# Altium schematic sheet PWR.SchDoc
size A4; SheetNumber: 8; SheetTotal: 8
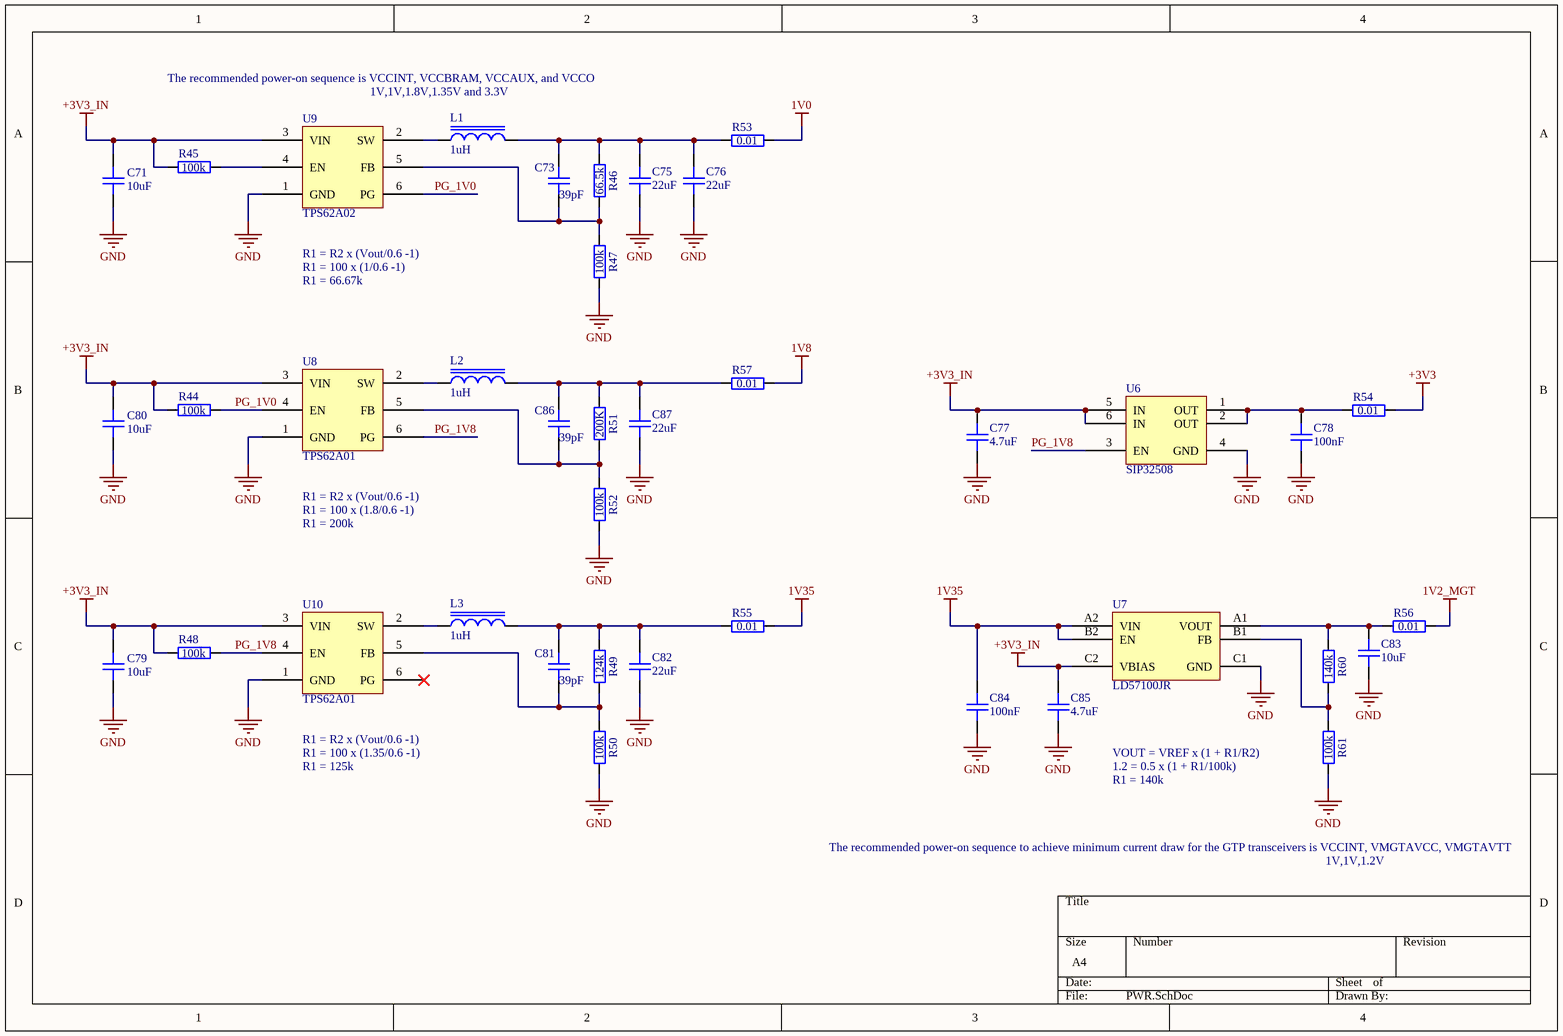
[diagram p0: PWR.SchDoc]

## Parts
C71  10uF  [GEN_C_0603]
C73  39pF  [GEN_C_0402]
C75  22uF  [GEN_C_0805]
C76  22uF  [GEN_C_0805]
C77  4.7uF  [GEN_C_0402]
C78  100nF  [GEN_C_0402]
C79  10uF  [GEN_C_0603]
C80  10uF  [GEN_C_0603]
C81  39pF  [GEN_C_0402]
C82  22uF  [GEN_C_0805]
C83  10uF  [GEN_C_0603]
C84  100nF  [GEN_C_0402]
C85  4.7uF  [GEN_C_0402]
C86  39pF  [GEN_C_0402]
C87  22uF  [GEN_C_0805]
L1  1uH  [GEN_L_1210]
L2  1uH  [GEN_L_1210]
L3  1uH  [GEN_L_1210]
R44  100k  [GEN_R_0402]
R45  100k  [GEN_R_0402]
R46  66.5k  [GEN_R_0402]
R47  100k  [GEN_R_0402]
R48  100k  [GEN_R_0402]
R49  124k  [GEN_R_0402]
R50  100k  [GEN_R_0402]
R51  200K  [GEN_R_0402]
R52  100k  [GEN_R_0402]
R53  0.01  [GEN_R_0603]
R54  0.01  [GEN_R_0603]
R55  0.01  [GEN_R_0603]
R56  0.01  [GEN_R_0603]
R57  0.01  [GEN_R_0603]
R60  140k  [GEN_R_0402]
R61  100k  [GEN_R_0402]
U6  SIP32508  [VISH_TSOT6]
U7  LD57100JR  [ST_FlipChip6]
U8  TPS62A01  [TI_SOT563_DRL0006A]
U9  TPS62A02  [TI_SOT563_DRL0006A]
U10  TPS62A01  [TI_SOT563_DRL0006A]

## Nets
1V0: R53.2
1V2_MGT: R56.2
1V8: R57.2
1V35: C84.2 R55.2 U7.A2(VIN) U7.B2(EN)
+3V3: R54.2
+3V3_IN: C71.2 C77.2 C79.2 C80.2 C85.2 R44.2 R45.2 R48.2 U6.5(IN) U6.6(IN) U7.C2(VBIAS) U8.3(VIN) U9.3(VIN) U10.3(VIN)
GND: C71.1 C75.1 C76.1 C77.1 C78.1 C79.1 C80.1 C82.1 C83.1 C84.1 C85.1 C87.1 R47.1 R50.1 R52.1 R61.1 U6.4(GND) U7.C1(GND) U8.1(GND) U9.1(GND) U10.1(GND)
PG_1V0: R44.1 U8.4(EN) U9.6(PG)
PG_1V8: R48.1 U6.3(EN) U8.6(PG) U10.4(EN)
NetC73_1: C73.1 R46.1 R47.2 U9.5(FB)
NetC73_2: C73.2 C75.2 C76.2 L1.2 R46.2 R53.1
NetC78_2: C78.2 R54.1 U6.1(OUT) U6.2(OUT)
NetC81_1: C81.1 R49.1 R50.2 U10.5(FB)
NetC81_2: C81.2 C82.2 L3.2 R49.2 R55.1
NetC83_2: C83.2 R56.1 R60.2 U7.A1(VOUT)
NetC86_1: C86.1 R51.1 R52.2 U8.5(FB)
NetC86_2: C86.2 C87.2 L2.2 R51.2 R57.1
NetL1_1: L1.1 U9.2(SW)
NetL2_1: L2.1 U8.2(SW)
NetL3_1: L3.1 U10.2(SW)
NetR45_1: R45.1 U9.4(EN)
NetR60_1: R60.1 R61.2 U7.B1(FB)

Not connected (* = marked no-connect by the designer): U10 6(PG)*

## Notes on the sheet
- The recommended power-on sequence is VCCINT, VCCBRAM, VCCAUX, and VCCO
- 1V,1V,1.8V,1.35V and 3.3V
- R1 = R2 x (Vout/0.6 -1)
- R1 = 100 x (1/0.6 -1)
- R1 = 66.67k
- R1 = 100 x (1.8/0.6 -1)
- R1 = 200k
- R1 = 100 x (1.35/0.6 -1)
- R1 = 125k
- VOUT = VREF x (1 + R1/R2)
- 1.2 = 0.5 x (1 + R1/100k)
- R1 = 140k
- The recommended power-on sequence to achieve minimum current draw for the GTP transceivers is VCCINT, VMGTAVCC, VMGTAVTT
- 1V,1V,1.2V

## Library data of the parts
C71 C79 C80 C83 = CAP 10uF 10V X5R 0603: Voltage Rating: 10V; Package: 0402; Supplier 1: Digi-Key; Supplier Part Number 1: 490-10474-1-ND; Value: 10uF
C73 C81 C86 = CAP 39pF 50V C0G 0402: Temperature Coefficient: C0G; Voltage Rating: 50V; Package: 0402; Value: 39pF; Supplier 1: Digi-Key; Supplier Part Number 1: 399-C0402C390J5GAC7867CT-ND
C75 C76 C82 C87 = CAP 22uF 25V X5R 0805: Voltage Rating: 25V; Package: 0805; Value: 22uF; Supplier 1: Digi-Key; Supplier Part Number 1: 490-10749-1-ND
C77 C85 = CAP 4.7uF 6.3V X5R 0402: Voltage Rating: 6.3V; Package: 0402; Value: 4.7uF; Supplier 1: Digi-Key; Supplier Part Number 1: 490-5915-1-ND
C78 C84 = CAP 100nF 16V X7R 0402: Voltage Rating: 16V; Package: 0402; Supplier 1: Digi-Key; Supplier Part Number 1: 490-4759-1-ND; Value: 100nF
L1-L3 = IND 1uH 5.5A 32 MOHM 1210: Value: 1uH; Supplier 1: Digi-Key; Supplier Part Number 1: 118-SRP3212-1R0MCT-ND
R44 R45 R47 R48 R50 R52 R61 = RES 100K OHM 1% 1/10W 0402: Tolerance: 1%; Power Rating: 0.1W; Package: 0402; Value: 100k; Supplier 1: Digi-Key; Supplier Part Number 1: 311-100KLRCT-ND
R46 = RES 66.5K OHM 1% 1/16W 0402: Tolerance: 1%; Power Rating: 0.0625W; Package: 0402; Value: 66.5k; Supplier 1: Digi-Key; Supplier Part Number 1: YAG3209CT-ND
R49 = RES 124K OHM 1% 1/10W 0402: Tolerance: 1%; Power Rating: 0.1W; Package: 0402; Value: 124k; Supplier 1: Digi-Key; Supplier Part Number 1: 311-124KLRCT-ND
R51 = RES 200K OHM 1% 1/16W 0402: Tolerance: 1%; Power Rating: 0.0625W; Package: 0402; Value: 200K; Supplier 1: Digi-Key; Supplier Part Number 1: 311-200KLRCT-ND
R53-R57 = RES 0.01 OHM 1% 1/4W 0603: Tolerance: 1%; Power Rating: 0.25W; Supplier 1: Digi-Key; Supplier Part Number 1: 408-1404-1-ND; Value: 0.01; Package: 0603
R60 = RES 140K OHM 1% 1/10W 0402: Tolerance: 1%; Power Rating: 0.1W; Package: 0402; Value: 140k; Supplier 1: Digi-Key; Supplier Part Number 1: YAG2978CT-ND
U6 = IC SWITCH LOAD SIP32508: Supplier 1: Digi-Key; Supplier Part Number 1: SIP32508DT-T1-GE3CT-ND
U7 = IC LDO LD57100JR: Supplier 1: Digi-Key; Supplier Part Number 1: 497-LD57100JRCT-ND
U8 U10 = IC BUCK TPS62A01: Supplier 1: Mouser; Supplier Part Number 1: 595-TPS62A01DRLR
U9 = IC BUCK TPS62A02: Supplier 1: Mouser; Supplier Part Number 1: 595-TPS62A02DRLR